# EAGLE design UV (EAGLE 7.6.0)
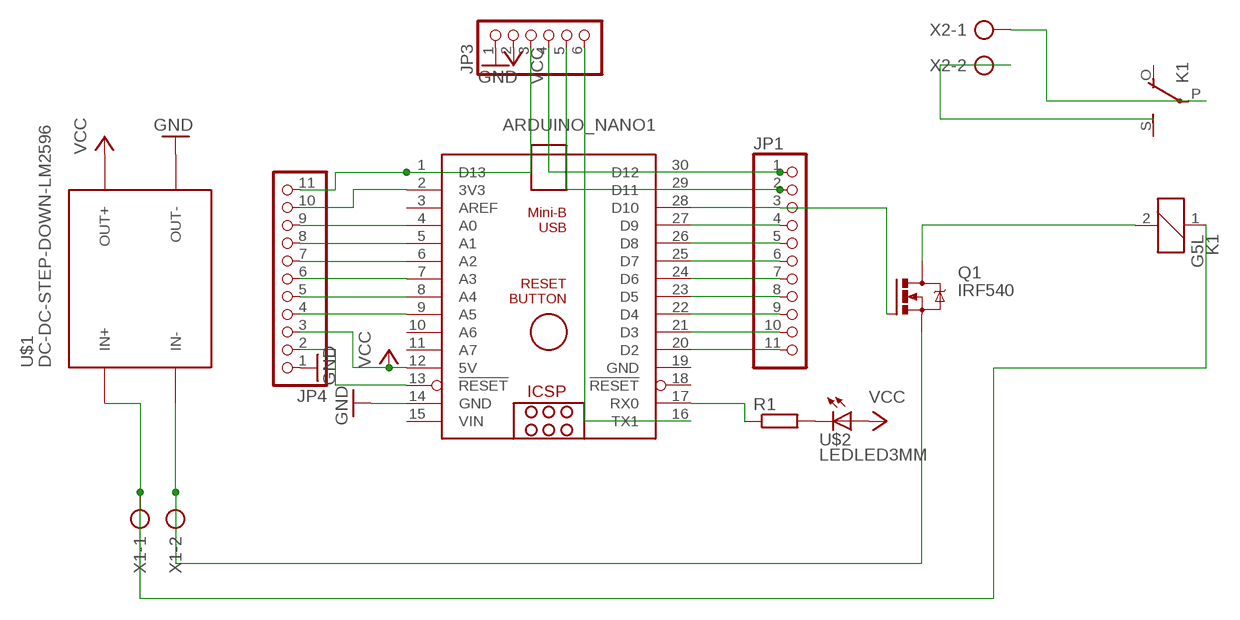
[diagram p0: schematic, sheet 1]

## Parts
ARDUINO_NANO1  ARDUINO_NANO  [ARDUINO_NANO]
JP1  PINHD-1X11  [1X11]
JP3  PINHD-1X6  [1X06]
JP4  PINHD-1X11  [1X11]
K1  G5L  [G5LE]
Q1  IRF540  [TO220BV]
R1  R-EU_0204/7  [0204/7]
U$1  DC-DC-STEP-DOWN-LM2596  [DC-DC-STEP-DOWN-LM2596]
U$2  LEDLED3MM  [LED3MM]
X1  AK300/2  [AK300/2]
X2  AK300/2  [AK300/2]

## Nets
GND: ARDUINO_NANO1.14(GND) JP3.1 JP4.1 U$1.OUT-
N$1: K1.1 U$1.IN+ X1.1
N$2: ARDUINO_NANO1.1(D13) JP3.3 JP4.11
N$3: ARDUINO_NANO1.30(D12) JP1.1 JP3.4
N$4: K1.2 Q1.D
N$5: ARDUINO_NANO1.29(D11) JP1.2 JP3.5
N$6: ARDUINO_NANO1.16(TX1) JP3.6
N$7: K1.P(2:P) X2.1
N$8: R1.2 U$2.K(C)
N$9: ARDUINO_NANO1.17(RX0) R1.1
N$10: ARDUINO_NANO1.27(D9) JP1.4
N$11: ARDUINO_NANO1.26(D8) JP1.5
N$12: ARDUINO_NANO1.25(D7) JP1.6
N$13: K1.S(2:S) X2.2
N$14: ARDUINO_NANO1.24(D6) JP1.7
N$15: ARDUINO_NANO1.23(D5) JP1.8
N$16: ARDUINO_NANO1.22(D4) JP1.9
N$17: ARDUINO_NANO1.21(D3) JP1.10
N$18: ARDUINO_NANO1.20(D2) JP1.11
N$19: Q1.S U$1.IN- X1.2
N$20: ARDUINO_NANO1.2(3V3) JP4.10
N$21: ARDUINO_NANO1.4(A0) JP4.9
N$22: ARDUINO_NANO1.5(A1) JP4.8
N$24: ARDUINO_NANO1.6(A2) JP4.7
N$25: ARDUINO_NANO1.7(A3) JP4.6
N$27: ARDUINO_NANO1.8(A4) JP4.5
N$28: ARDUINO_NANO1.9(A5) JP4.4
N$29: ARDUINO_NANO1.13(!RESET) JP4.2
N$30: ARDUINO_NANO1.28(D10) JP1.3 Q1.G
VCC: ARDUINO_NANO1.12(5V) JP3.2 JP4.3 U$1.OUT+ U$2.A
Unconnected: ARDUINO_NANO1.3(AREF) ARDUINO_NANO1.10(A6) ARDUINO_NANO1.11(A7) ARDUINO_NANO1.18(!RESET) K1.O(2:O)

## Power pins joined to a net without a drawn wire
GND: ARDUINO_NANO1.19(GND)
VIN: ARDUINO_NANO1.15(VIN)

## Library data of the parts
ARDUINO_NANO1 = ArduinoNanoV30:ARDUINO_NANO: Arduino Nano V3.0 Overview: The Arduino Nano is a small, complete, and breadboard-friendly board based on the ATmega328 (Arduino Nano 3.x) or ATmega168 (Arduino Nano 2.x). It has more or less the same functionality of the Arduino Duemilanove, but in a different package. It lacks only a DC power jack, and works with a Mini-B USB cable instead of a standard one. The Nano was designed and is being produced by Gravitech. Specifications: Microcontroller Atmel ATmega168 or ATmega328 Operating Voltage (logic level) 5 V Input Voltage (recommended) 7-12 V Input Voltage (limits) 6-20 V Digital I/O Pins 14 (of which 6 provide PWM output) Analog Input Pins 8 DC Current per I/O Pin 40 mA Flash Memory 16 KB (ATmega168) or 32 KB (ATmega328) of which 2 KB used by bootloader SRAM 1 KB (ATmega168) or 2 KB (ATmega328) EEPROM 512 bytes (ATmega168) or 1 KB (ATmega328) Clock Speed 16 MHz Dimensions 0.73" x 1.70" Length 45 mm Width 18 mm Weigth 5 g Power: The Arduino Nano can be powered via the Mini-B USB connection, 6-20V unregulated external power supply (pin 30), or 5V regulated external power supply (pin 27). The power source is automatically selected to the highest voltage source. Memory: The ATmega168 has 16 KB of flash memory for storing code (of which 2 KB is used for the bootloader); the ATmega328 has 32 KB, (also with 2 KB used for the bootloader). The ATmega168 has 1 KB of SRAM and 512 bytes of EEPROM (which can be read and written with the EEPROM library); the ATmega328 has 2 KB of SRAM and 1 KB of EEPROM. Input and Output: Each of the 14 digital pins on the Nano can be used as an input or output, using pinMode(), digitalWrite(), and digitalRead() functions. They operate at 5 volts. Each pin can provide or receive a maximum of 40 mA and has an internal pull-up resistor (disconnected by default) of 20-50 kOhms. In addition, some pins have specialized functions. Visit Arduino - ArduinoBoardNano <https://www.arduino.cc/en/Main/ArduinoBoardNano>
JP1 JP4 = pinhead:PINHD-1X11: PIN HEADER
JP3 = pinhead:PINHD-1X6: PIN HEADER
K1 = relay:G5L: RELAY 1 x switch, 10 A/120 V AC, 8 A/30 V ADC, Omron; OC_FARNELL: unknown; OC_NEWARK: unknown
Q1 = transistor-power:IRF540: HEXFET Power MOSFET
R1 = resistor:R-EU_: RESISTOR, European symbol
U$1 = diy-modules:DC-DC-STEP-DOWN-LM2596: DC/DC Step-Down Regulator based on LM2596-ADJ chip LM2596 datasheet available here: http://www.ti.com/lit/ds/symlink/lm2596.pdf Click here to find device on ebay.com <http://www.ebay.com/sch/lm2596+power+regulator>
U$2 = Clean-Kong:LED
X1 X2 = con-ptr500:AK300/2: CONNECTOR; OC_FARNELL: unknown; OC_NEWARK: unknown

## Board
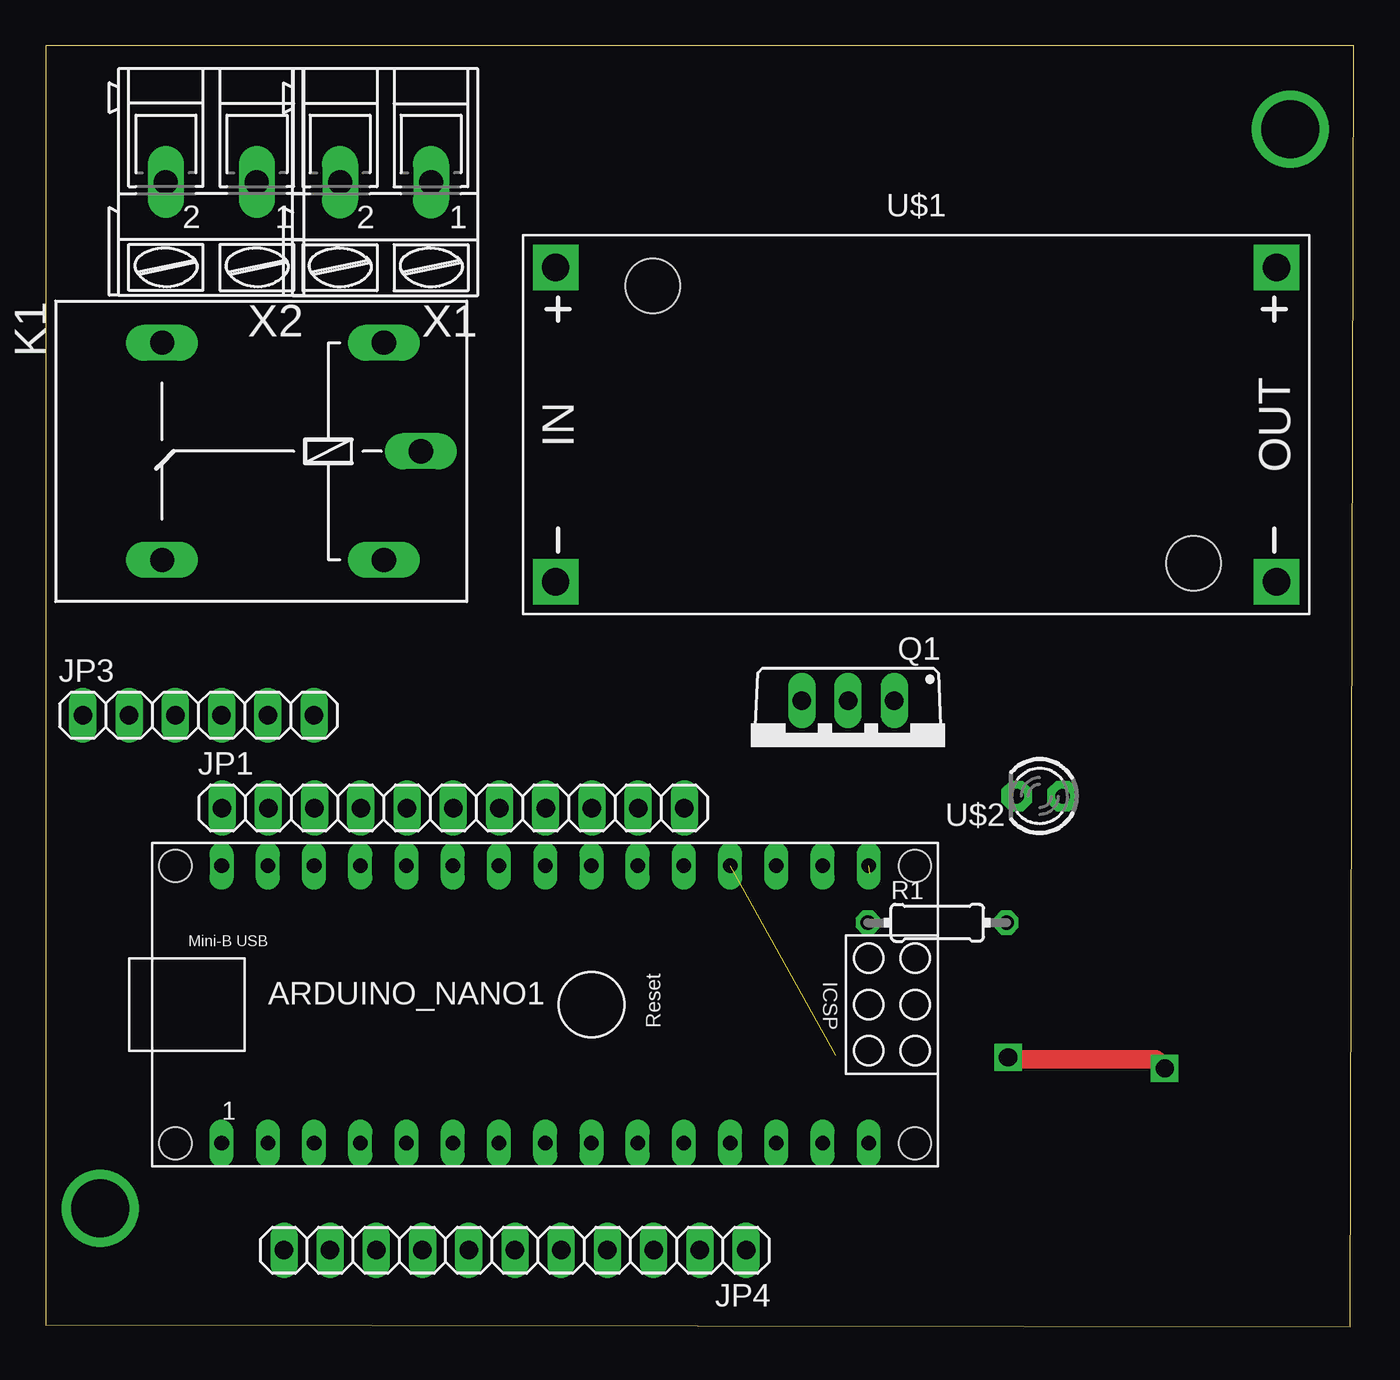
[diagram p1: board, top side]
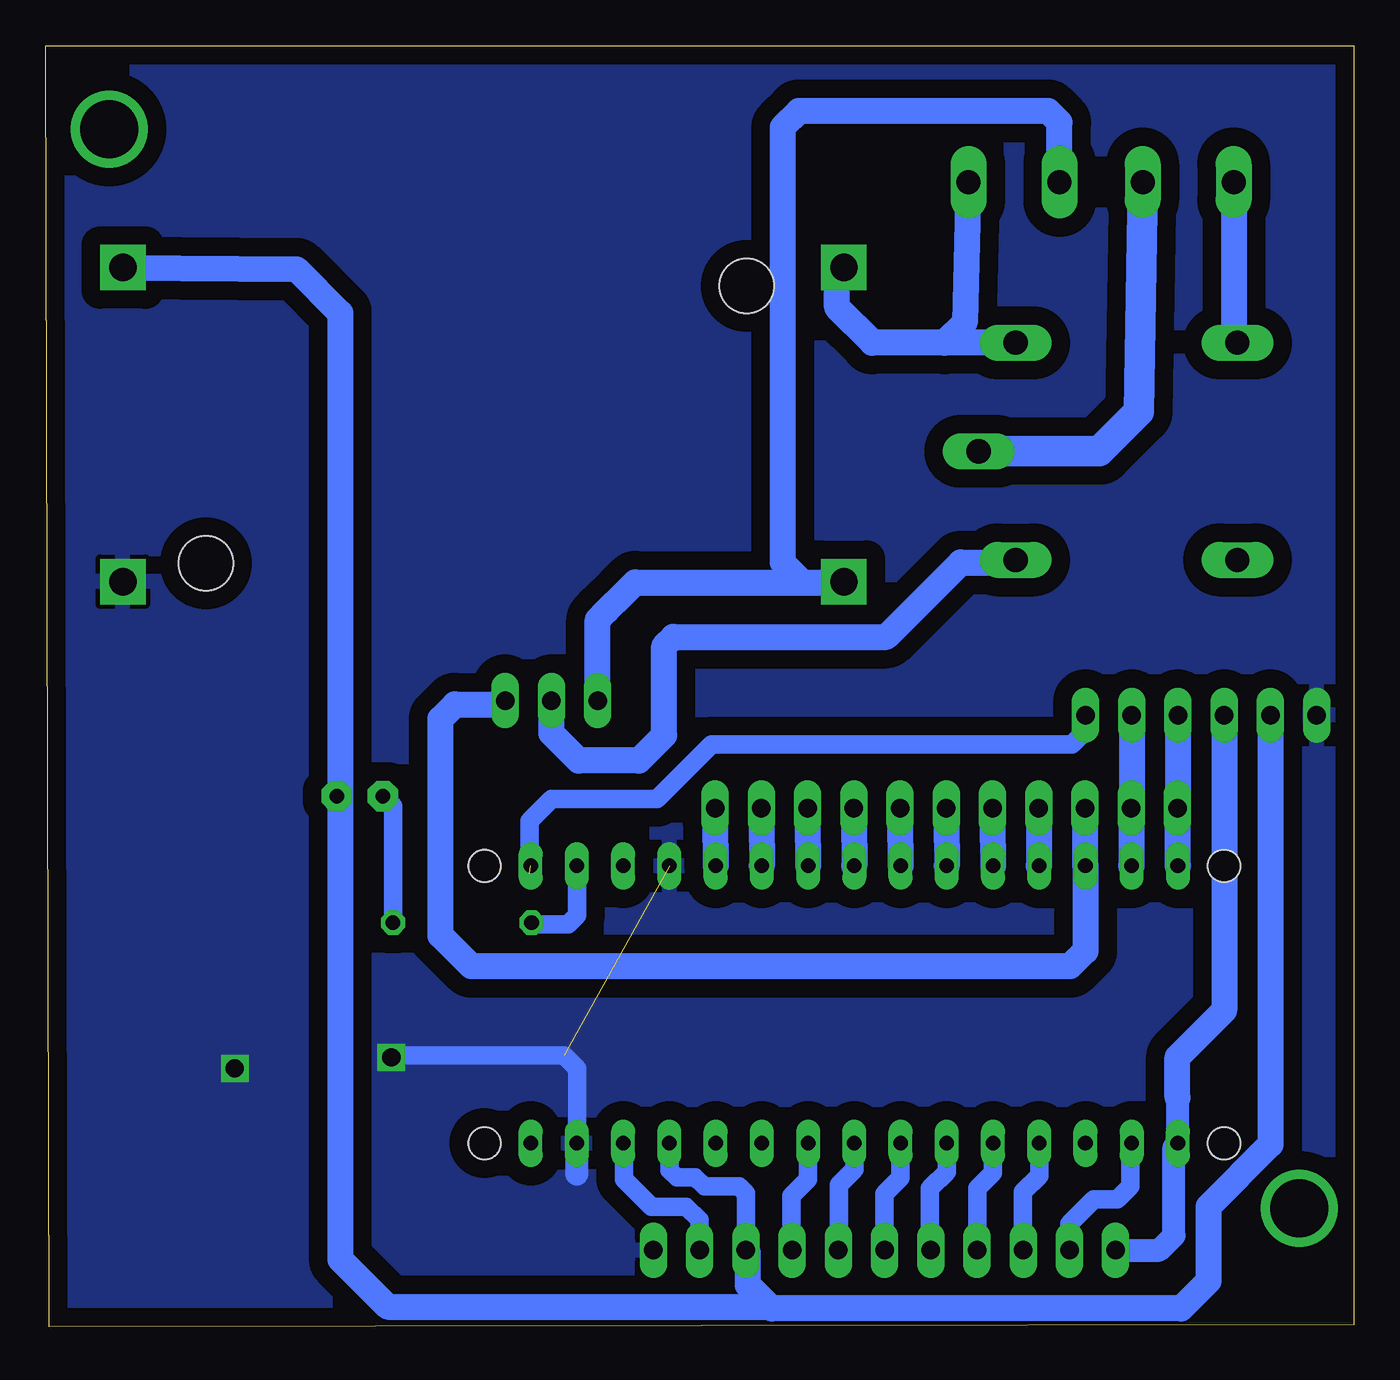
[diagram p2: board, bottom side, seen from below]

Size 71.9 x 70.4 mm. Coordinates in mm from the lower left corner, seen from the top.
Outline: 0,0.1 71.7,0 71.9,70.4 0,70.4 0,0.1
Copper layers (1*16): Top 0.035mm / dielectric 1.5mm / Bottom 0.035mm
Design rules "default": minimum track width 10mil, minimum drill 24mil, track to track 8mil, track to pad 8mil, pad to pad 8mil, via to via 8mil, smd to smd 8mil, copper to edge 40mil, drill to drill 8mil, minimum pad ring 10mil, minimum via ring 8mil, stop-mask expansion 4mil, vias tented up to drill 0mil, thermal gap 10mil

### Footprints (pad centres in the part's own frame; a part is rotated, then mirrored left to right if it is on the bottom)
ARDUINO_NANO = drill 0.8 long: 1 -20.32,-7.62; 2 -17.78,-7.62; 3 -15.24,-7.62; 4 -12.7,-7.62; 5 -10.16,-7.62; 6 -7.62,-7.62; 7 -5.08,-7.62; 8 -2.54,-7.62; 9 0,-7.62; 10 2.54,-7.62; 11 5.08,-7.62; 12 7.62,-7.62; 13 10.16,-7.62; 14 12.7,-7.62; 15 15.24,-7.62; 16 15.24,7.62; 17 12.7,7.62; 18 10.16,7.62; 19 7.62,7.62; 20 5.08,7.62; 21 2.54,7.62; 22 0,7.62; 23 -2.54,7.62; 24 -5.08,7.62; 25 -7.62,7.62; 26 -10.16,7.62; 27 -12.7,7.62; 28 -15.24,7.62; 29 -17.78,7.62; 30 -20.32,7.62 | hole 1.778: -22.86,-7.62; -22.86,7.62; 17.78,7.62; 17.78,-7.62
1X11 = drill 1.016 long: 1 -12.7,0; 2 -10.16,0; 3 -7.62,0; 4 -5.08,0; 5 -2.54,0; 6 0,0; 7 2.54,0; 8 5.08,0; 9 7.62,0; 10 10.16,0; 11 12.7,0
1X06 = drill 1.016 long: 1 -6.35,0; 2 -3.81,0; 3 -1.27,0; 4 1.27,0; 5 3.81,0; 6 6.35,0
G5LE = drill 1.321 long: 1 -7.493,-5.969; 2 -7.493,5.969; O 4.699,5.969; P -9.525,0; S 4.699,-5.969
TO220BV = drill 1.016 long: D 0,-2.54; G -2.54,-2.54; S 2.54,-2.54
0204/7 = drill 0.813 octagon: 1 -3.81,0; 2 3.81,0
DC-DC-STEP-DOWN-LM2596 = drill 1.5 pad 2.5 square: IN+ -19.812,8.636; IN- -19.812,-8.636; OUT+ 19.812,8.636; OUT- 19.812,-8.636 | hole 3: -14.478,7.62; 15.24,-7.62
LED3MM = drill 0.8 pad 1.676 octagon: A 0,0; K 2.54,0
AK300/2 = drill 1.321 long: 1 -2.515,0; 2 2.489,0

### Placement (x,y rotation side)
ARDUINO_NANO1  30,17.7 0 top
JP1  22.4,28.5 0 top
JP3  8.4,33.6 0 top
JP4  25.8,4.2 180 top
K1  11.1,48.1 180 top
Q1  44.1,31.86 180 top
R1  49,22.2 0 top
U$1  47.84,49.57 0 top
U$2  55.9,29.16 180 top
X1  18.67,62.89 180 top
X2  9.1,62.9 180 top

### Tracks (layer width: path | path; a pad name or v marks a point on that pad's centre or on a via)
GND  (via drill 1)  (1 unrouted)
  Top 1.016: v52.9,14.8 52.8,14.7 61,14.7 v61.5,14.2
  Bottom 1.016: ARDUINO_NANO1.14 42.7,14.2 43.4,14.9 52.8,14.9 v52.9,14.8
  Bottom 1.27: 42.7,8.4 ARDUINO_NANO1.14
  pour Bottom (isolate 1.016): 0.3,70.6 71.4,70.6 71.7,0.5 0.4,0.3
N$1
  Bottom 1.422: K1.1 22.5,54.07 | 22.5,54.07 26.47,54.07 28.4,56 28.4,57.98 U$1.IN+ | X1.1 21.39,55.18 22.5,54.07
N$2
  Bottom 1.27: JP4.11 10.7,4.2 9.9,5 9.9,9.86 ARDUINO_NANO1.1 9.7,10.1 9.7,12.6
  Bottom 1.422: 9.7,12.6 9.7,14.8 7.13,17.37 JP3.3
N$3
  Bottom 1.422: ARDUINO_NANO1.30 9.7,25.34 JP1.1 9.67,28.53 JP3.4
N$4
  Bottom 1.422: K1.2 18.72,42 21.6,42 25.7,37.9 37.4,37.9 37.9,37.4 37.9,32.5 39.3,31.1 42.6,31.1 44.1,32.6 Q1.D
N$5
  Bottom 1.422: ARDUINO_NANO1.29 12.24,25.34 JP1.2 12.21,28.53 JP3.5
N$6  (1 unrouted)
  Bottom 1.016: JP3.6 14.85,32.65 15.5,32 35.3,32 38.3,29 44.1,29 45.3,27.8 45.3,24.9 45.4,24.8
N$7
  Bottom 1.676: X2.1 11.81,50.28 14,48.1 K1.P
N$8
  Bottom 1.016: R1.2 52.81,28.61 U$2.K
N$9
  Bottom 1.016: ARDUINO_NANO1.17 42.7,22.6 43.2,22.1 45.09,22.1 R1.1
N$10
  Bottom 1.422: JP1.4 17.32,25.34 ARDUINO_NANO1.27
N$11
  Bottom 1.422: JP1.5 19.86,27.84 ARDUINO_NANO1.26
N$12
  Bottom 1.422: JP1.6 22.4,27.84 ARDUINO_NANO1.25
N$13
  Bottom 1.422: X2.2 6.61,54.28 K1.S
N$14
  Bottom 1.422: JP1.7 24.94,27.84 ARDUINO_NANO1.24
N$15
  Bottom 1.422: JP1.8 27.48,27.84 ARDUINO_NANO1.23
N$16
  Bottom 1.422: JP1.9 30.02,27.84 ARDUINO_NANO1.22
N$17
  Bottom 1.422: JP1.10 32.56,27.84 ARDUINO_NANO1.21
N$18
  Bottom 1.422: JP1.11 35.1,27.84 ARDUINO_NANO1.20
N$19
  Bottom 1.422: 30.3,40.9 39.5,40.9 40.15,40.25 41.06,39.34 41.56,38.84 Q1.S | 30.3,40.9 28.06,40.9 U$1.IN- | 30.3,40.9 31.4,42 31.4,65.9 30.5,66.8 16.8,66.8 16.18,66.18 X1.2
N$20
  Bottom 1.016: JP4.10 15.64,5.66 14.3,7 13,7 12.3,7.7 12.3,10 ARDUINO_NANO1.2
N$21
  Bottom 1.016: ARDUINO_NANO1.4 17.3,8.3 18.2,7.4 18.2,4.22 JP4.9
N$22
  Bottom 1.016: ARDUINO_NANO1.5 19.84,8.46 20.7,7.6 20.7,4.22 JP4.8
N$23  (via drill 3.2)
  other vias: 3,6.5
N$24
  Bottom 1.016: ARDUINO_NANO1.6 22.38,8.52 23.3,7.6 23.3,4.24 JP4.7
N$25
  Bottom 1.016: ARDUINO_NANO1.7 24.92,8.18 25.8,7.3 JP4.6
N$26  (via drill 3.2)
  other vias: 68.4,65.8
N$27
  Bottom 1.016: ARDUINO_NANO1.8 27.46,8.64 28.3,7.8 28.3,4.24 JP4.5
N$28
  Bottom 1.016: ARDUINO_NANO1.9 30,8.1 30.9,7.2 30.9,4.22 JP4.4
N$29
  Bottom 1.016: JP4.2 35.96,5.86 36.7,6.6 38.6,6.6 40.1,8.1 40.1,10.02 ARDUINO_NANO1.13
N$30
  Bottom 1.422: JP1.3 14.78,25.34 ARDUINO_NANO1.28 14.76,20.64 15.6,19.8 48.5,19.8 50.2,21.5 50.2,33.4 49.4,34.2 46.84,34.2 Q1.G
VCC
  Bottom 1.016: JP4.3 33.42,7.32 33.8,7.7 35.7,7.7 36.2,8.2 37.2,8.2 37.6,8.6 37.6,10.06 ARDUINO_NANO1.12
  Bottom 1.422: U$1.OUT+ 58.11,58.11 55.7,55.7 55.7,29.36 | 55.7,29.36 U$2.A | JP3.2 4.59,10.01 8,6.6 8,2.5 9.5,1 32,1 32.1,1.1 | 32.1,1.1 33.3,2.3 33.3,4.08 JP4.3 | 55.7,29.36 55.7,3.7 53.1,1.1 32.1,1.1